# EAGLE design tiny (EAGLE 7.1.0)
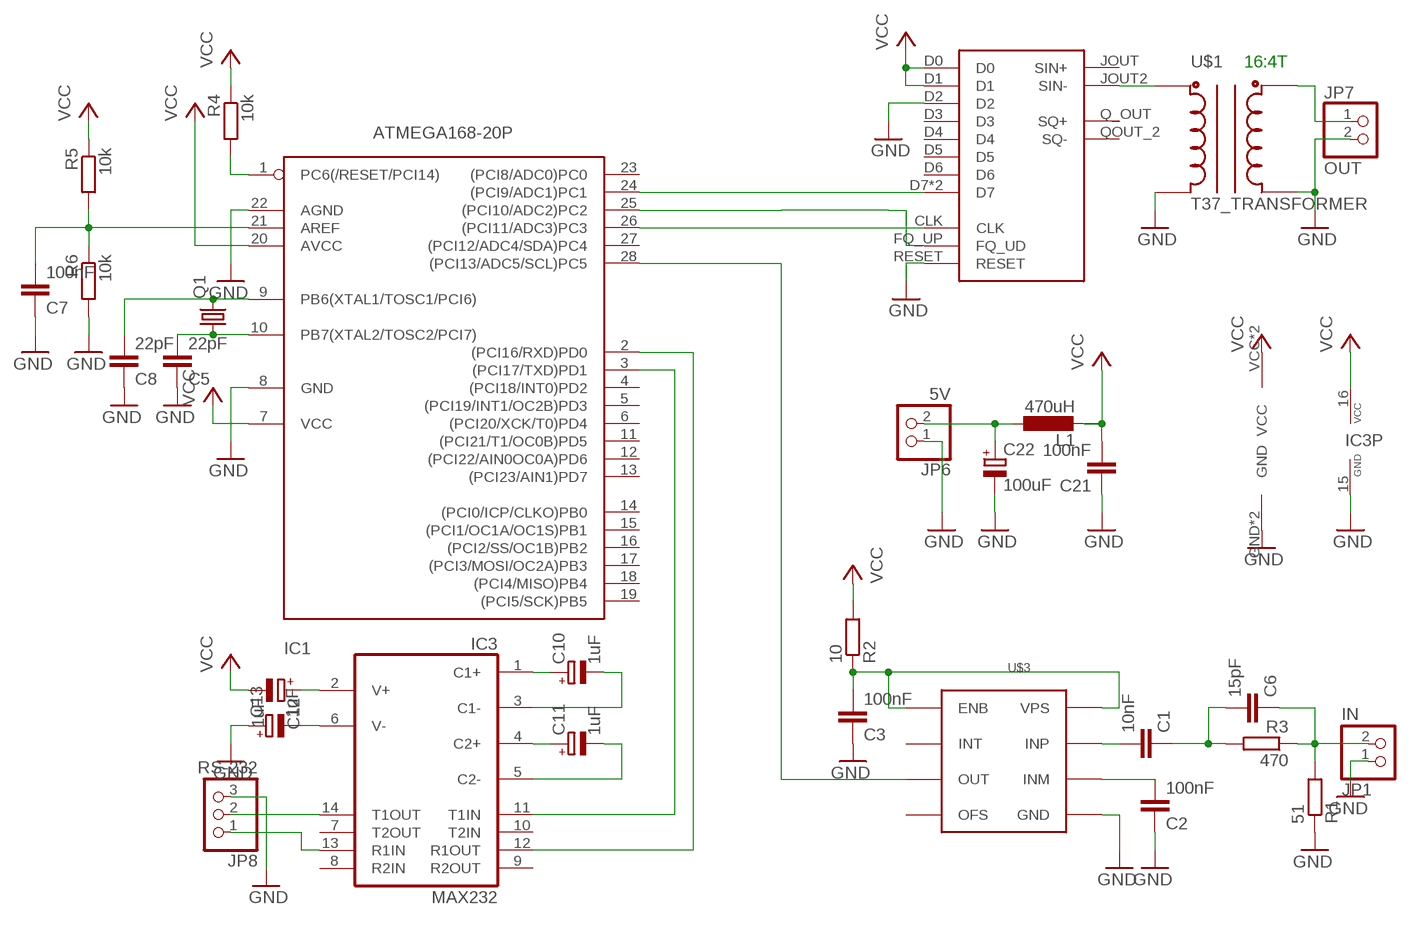
[diagram p0: schematic, sheet 1]

## Parts
C1  10nF  C-EU050-025X075  [C050-025X075]
C2  100nF  C-EU025-025X050  [C025-025X050]
C3  100nF  C-EU025-025X050  [C025-025X050]
C5  22pF  C-EU050-025X075  [C050-025X075]
C6  15pF  C-EU050-025X075  [C050-025X075]
C7  100nF  C-EU025-025X050  [C025-025X050]
C8  22pF  C-EU025-025X050  [C025-025X050]
C10  1uF  CPOL-EUE5-5  [E5-5]
C11  1uF  CPOL-EUE2.5-5  [E2,5-5]
C12  1uF  CPOL-EUE2.5-6  [E2,5-6]
C13  1uF  CPOL-EUE5-5  [E5-5]
C21  100nF  C-EU025-025X050  [C025-025X050]
C22  100uF  CPOL-EUE2.5-6  [E2,5-6]
IC1  ATMEGA168-20P  [DIL28-3]
IC3  MAX232  [DIL16]
JP1  IN  PINHD-1X2  [1X02]
JP6  5V  PINHD-1X2  [1X02]
JP7  OUT  PINHD-1X2  [1X02]
JP8  RS-232  PINHD-1X3  [1X03]
L1  470uH  L-EU0204/7  [0204/7]
Q1  CRYSTALHC18U-V  [HC18U-V]
R1  51  R-EU_0204/2V  [0204V]
R2  10  R-EU_0204/7  [0204/7]
R3  470  R-EU_0204/5  [0204/5]
R4  10k  R-EU_0204/7  [0204/7]
R5  10k  R-EU_0204/2V  [0204V]
R6  10k  R-EU_0204/2V  [0204V]
U$1  T37_TRANSFORMER  [T37_TRANSFORMER]
U$2  DDS-1  [DDS-1]
U$3  AD8307  [DIL08]

## Nets
GND: C2.1 C3.1 C5.1 C7.1 C8.1 C13.+ C21.1 C22.- IC1.8(GND) IC1.22(AGND) IC3.15(GND) JP1.1 JP6.1 JP7.2 JP8.3 R1.1 R6.2 U$1.C1A U$1.C2A U$2.D2 U$2.GND U$2.GND2(GND) U$2.RESET U$3.2(GND)
N$1: IC1.1(PC6(/RESET/PCI14)) R4.2
N$2: C6.1 JP1.2 R1.2 R3.1
N$3: C1.2 U$3.8(INP)
N$4: C2.2 U$3.1(INM)
N$5: C5.2 IC1.10(PB7(XTAL2/TOSC2/PCI7)) Q1.1
N$6: C8.2 IC1.9(PB6(XTAL1/TOSC1/PCI6)) Q1.2
N$7: C12.+ IC3.2(V+)
N$8: C3.2 R2.1 U$3.6(ENB) U$3.7(VPS)
N$9: IC1.28((PCI13/ADC5/SCL)PC5) U$3.4(OUT)
N$10: C22.+ JP6.2 L1.1
N$11: IC3.14(T1OUT) JP8.2
N$12: C1.1 C6.2 R3.2
N$13: U$1.C1B U$2.JOUT2(SIN-)
N$14: JP7.1 U$1.C2B
N$15: IC1.25((PCI10/ADC2)PC2) U$2.FQ_UP(FQ_UD)
N$16: C13.- IC3.6(V-)
N$17: IC1.3((PCI17/TXD)PD1) IC3.11(T1IN)
N$22: IC1.2((PCI16/RXD)PD0) IC3.12(R1OUT)
N$26: IC1.26((PCI11/ADC3)PC3) U$2.CLK
N$29: C7.2 IC1.21(AREF) R5.2 R6.1
N$30: IC1.24((PCI9/ADC1)PC1) U$2.D7 U$2.D7_2(D7)
N$34: IC3.13(R1IN) JP8.1
N$38: C10.+ IC3.1(C1+)
N$39: C10.- IC3.3(C1-)
N$40: C11.+ IC3.4(C2+)
N$41: C11.- IC3.5(C2-)
VCC: C12.- C21.2 IC1.7(VCC) IC1.20(AVCC) IC3.16(VCC) L1.2 R2.2 R4.1 R5.1 U$2.D0 U$2.D1 U$2.VCC U$2.VCC2(VCC)
Unconnected: IC1.4((PCI18/INT0)PD2) IC1.5((PCI19/INT1/OC2B)PD3) IC1.6((PCI20/XCK/T0)PD4) IC1.11((PCI21/T1/OC0B)PD5) IC1.12((PCI22/AIN0OC0A)PD6) IC1.13((PCI23/AIN1)PD7) IC1.14((PCI0/ICP/CLKO)PB0) IC1.15((PCI1/OC1A/OC1S)PB1) IC1.16((PCI2/SS/OC1B)PB2) IC1.17((PCI3/MOSI/OC2A)PB3) IC1.18((PCI4/MISO)PB4) IC1.19((PCI5/SCK)PB5) IC1.23((PCI8/ADC0)PC0) IC1.27((PCI12/ADC4/SDA)PC4) IC3.7(T2OUT) IC3.8(R2IN) IC3.9(R2OUT) IC3.10(T2IN) U$2.D3 U$2.D4 U$2.D5 U$2.D6 U$2.JOUT(SIN+) U$2.Q_OUT(SQ+) U$2.QOUT_2(SQ-) U$3.3(OFS) U$3.5(INT)

## Notes on the sheet
- 16:4T

## Library data of the parts
C1-C3 C5-C8 C21 = rcl:C-EU: CAPACITOR, European symbol
C10-C13 C22 = rcl:CPOL-EU: POLARIZED CAPACITOR, European symbol
IC1 = adafruit:ATMEGA168*P: MICROCONTROLLER 16 kBytes FLASH 1 kBytes SRAM 512 Bytes EEPROM USART 8-channel 10 bit ADC
IC3 = maxim:MAX232: RS232 TRANSCEIVER; MF: MAXIM; MPN: MAX232ACPE+; OC_FARNELL: 9723773; OC_NEWARK: 68K4544
JP1 JP6 JP7 = pinhead:PINHD-1X2: PIN HEADER
JP8 = pinhead:PINHD-1X3: PIN HEADER
L1 = rcl:L-EU: INDUCTOR, European symbol
Q1 = crystal:CRYSTAL: CRYSTAL; OC_FARNELL: unknown; OC_NEWARK: unknown
R1-R6 = rcl:R-EU_: RESISTOR, European symbol
U$1 = toroid:T37_TRANSFORMER: Transformer wound on a T37 Toroid
U$2 = minikits:DDS-1
U$3 = -- Eigene:AD8307

## Board
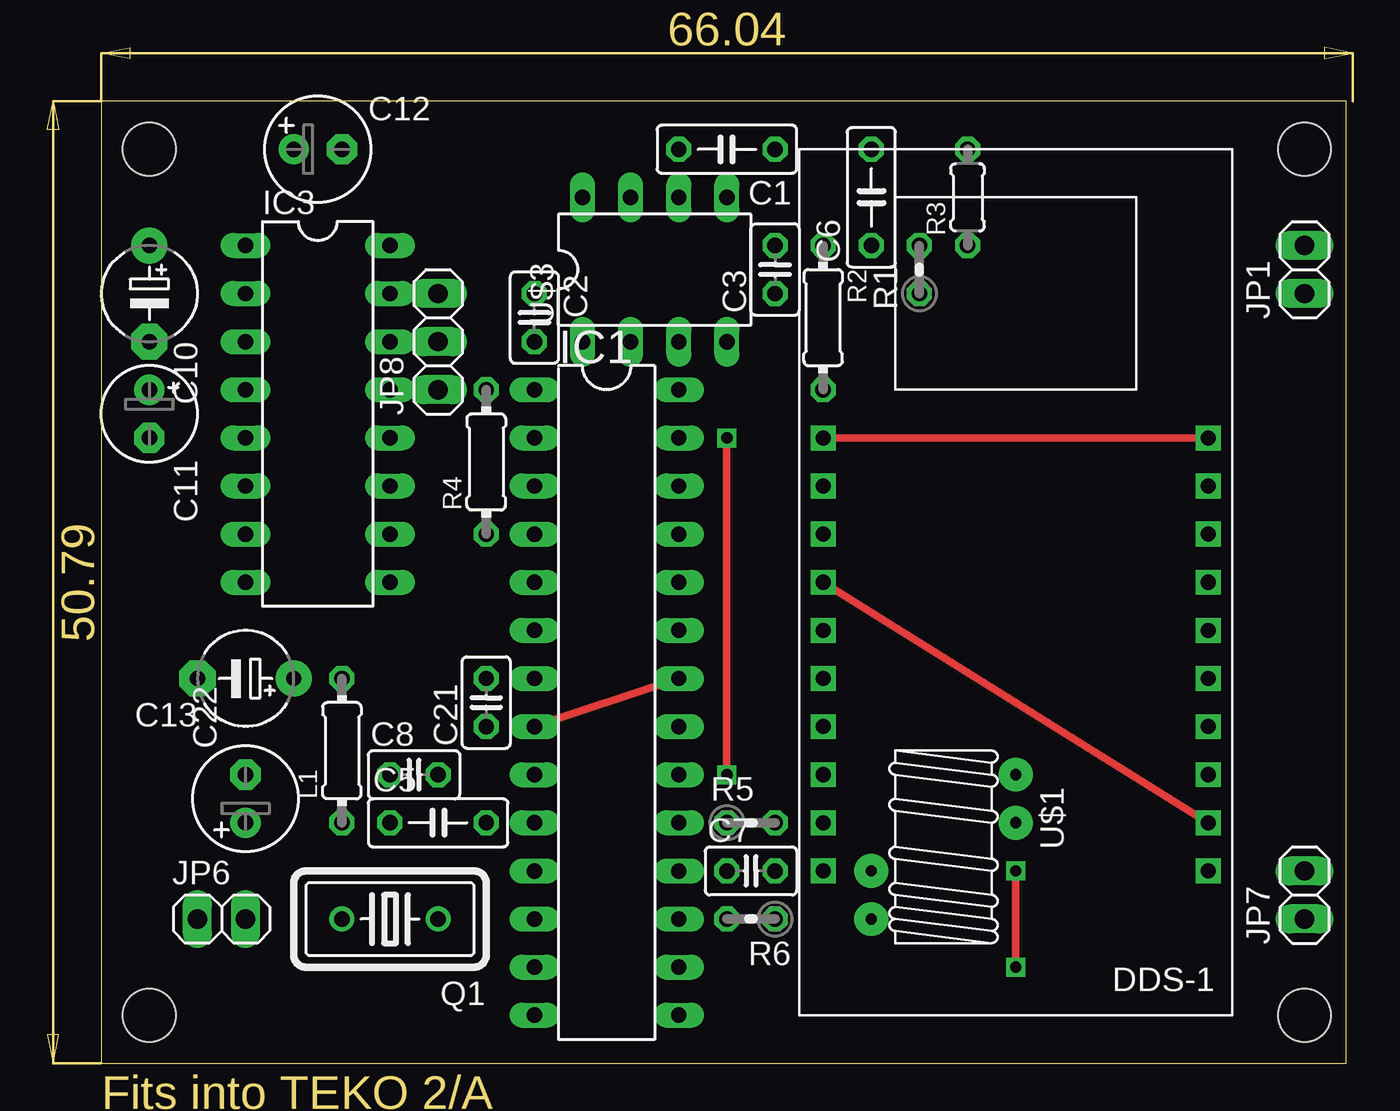
[diagram p1: board, top side]
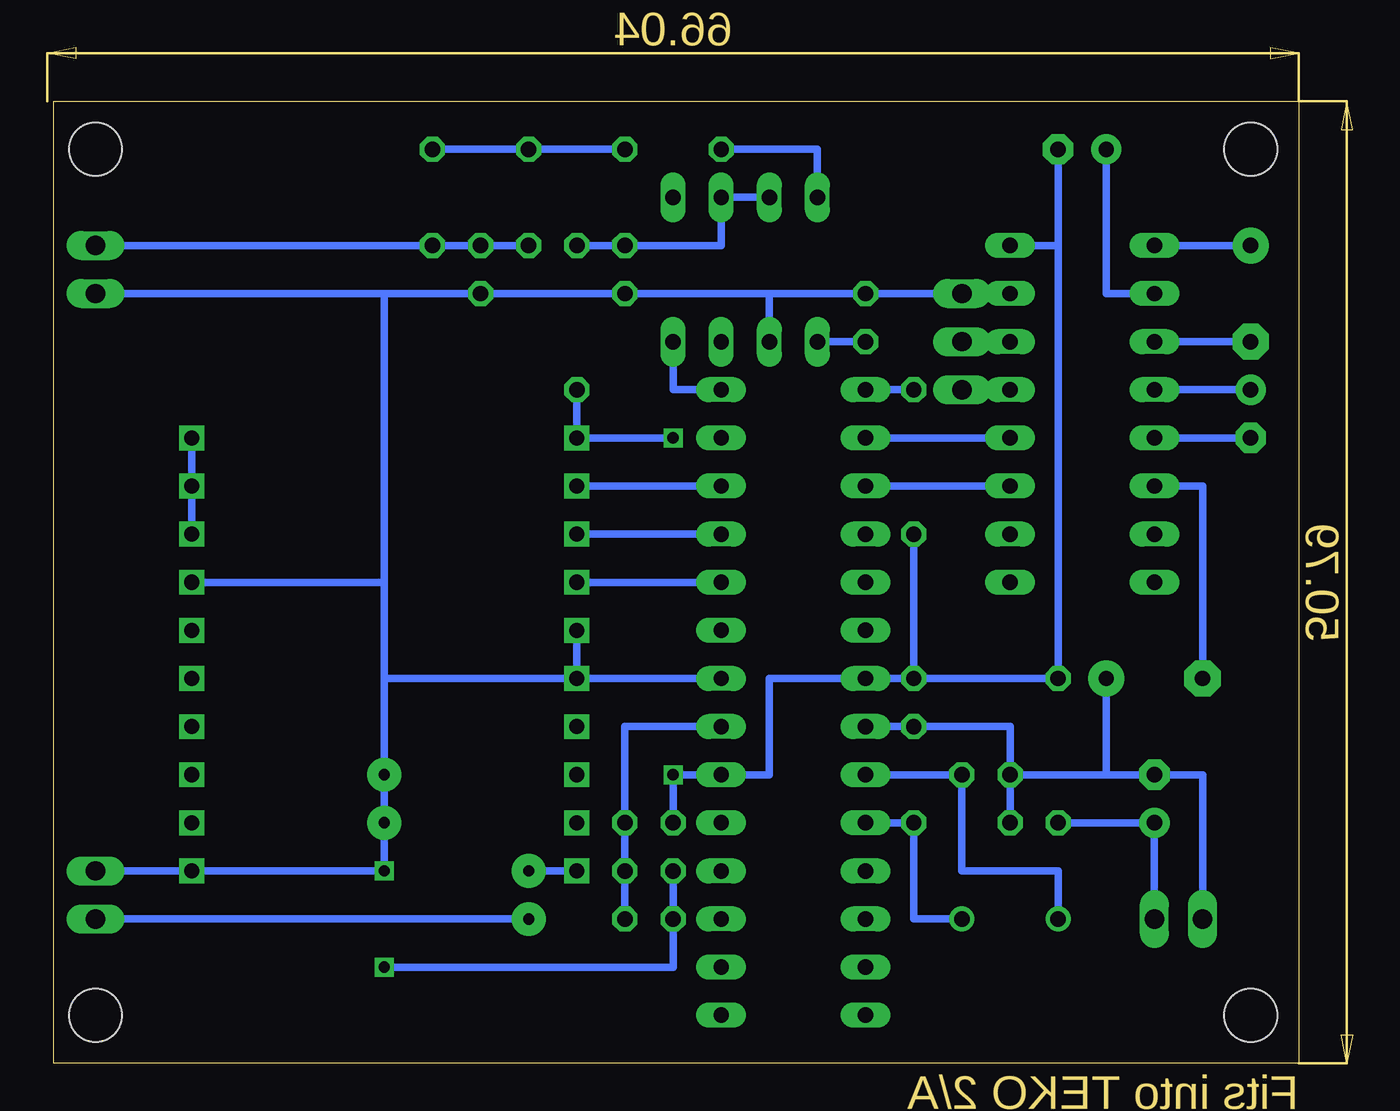
[diagram p2: board, bottom side, seen from below]

Size 65.71 x 50.79 mm. Coordinates in mm from the lower left corner, seen from the top.
Outline: 0,0 65.71,0 65.71,50.79 0,50.79 0,0
Copper layers (1*16): Top 0.035mm / dielectric 1.5mm / Bottom 0.035mm
Design rules "default": minimum track width 10mil, minimum drill 24mil, track to track 8mil, track to pad 8mil, pad to pad 8mil, via to via 8mil, smd to smd 8mil, copper to edge 40mil, drill to drill 8mil, minimum pad ring 10mil, minimum via ring 8mil, stop-mask expansion 4mil, vias tented up to drill 0mil, thermal gap 10mil
Holes 2.8 mm at 2.54,48.26 63.5,48.26 63.5,2.54 2.54,2.54

### Footprints (pad centres in the part's own frame; a part is rotated, then mirrored left to right if it is on the bottom)
C050-025X075 = drill 0.813 octagon: 1 -2.54,0; 2 2.54,0
C025-025X050 = drill 0.813 octagon: 1 -1.27,0; 2 1.27,0
E5-5 = drill 0.813 pad 1.905: + -2.54,0 | drill 0.813 pad 1.905 octagon: - 2.54,0
E2,5-5 = drill 0.813 pad 1.6: + -1.27,0 | drill 0.813 pad 1.6 octagon: - 1.27,0
E2,5-6 = drill 0.813 pad 1.6: + -1.27,0 | drill 0.813 pad 1.6 octagon: - 1.27,0
DIL28-3 = drill 0.813 long: 1 -16.51,-3.81; 2 -13.97,-3.81; 3 -11.43,-3.81; 4 -8.89,-3.81; 5 -6.35,-3.81; 6 -3.81,-3.81; 7 -1.27,-3.81; 8 1.27,-3.81; 9 3.81,-3.81; 10 6.35,-3.81; 11 8.89,-3.81; 12 11.43,-3.81; 13 13.97,-3.81; 14 16.51,-3.81; 15 16.51,3.81; 16 13.97,3.81; 17 11.43,3.81; 18 8.89,3.81; 19 6.35,3.81; 20 3.81,3.81; 21 1.27,3.81; 22 -1.27,3.81; 23 -3.81,3.81; 24 -6.35,3.81; 25 -8.89,3.81; 26 -11.43,3.81; 27 -13.97,3.81; 28 -16.51,3.81
DIL16 = drill 0.813 long: 1 -8.89,-3.81; 2 -6.35,-3.81; 3 -3.81,-3.81; 4 -1.27,-3.81; 5 1.27,-3.81; 6 3.81,-3.81; 7 6.35,-3.81; 8 8.89,-3.81; 9 8.89,3.81; 10 6.35,3.81; 11 3.81,3.81; 12 1.27,3.81; 13 -1.27,3.81; 14 -3.81,3.81; 15 -6.35,3.81; 16 -8.89,3.81
1X02 = drill 1.016 long: 1 -1.27,0; 2 1.27,0
1X03 = drill 1.016 long: 1 -2.54,0; 2 0,0; 3 2.54,0
0204/7 = drill 0.813 octagon: 1 -3.81,0; 2 3.81,0
HC18U-V = drill 0.813: 1 -2.54,0; 2 2.54,0
0204V = drill 0.813 octagon: 1 -1.27,0; 2 1.27,0
0204/5 = drill 0.813 octagon: 1 -2.54,0; 2 2.54,0
T37_TRANSFORMER = drill 0.6 pad 1.778: C1A -3.81,-3.81; C1B 3.81,1.27; C2A -3.81,-1.27; C2B 3.81,3.81
DDS-1 = drill 0.8 square: CLK -11.43,7.62; D0 8.89,7.62; D1 8.89,5.08; D2 8.89,2.54; D3 8.89,0; D4 8.89,-2.54; D5 8.89,-5.08; D6 8.89,-7.62; D7 -11.43,2.54; D7_2 8.89,-10.16; FQ_UP -11.43,5.08; GND -11.43,-2.54; GND2 8.89,-12.7; JOUT -11.43,-10.16; JOUT2 -11.43,-12.7; Q_OUT -11.43,-5.08; QOUT_2 -11.43,-7.62; RESET -11.43,0; VCC -11.43,10.16; VCC2 8.89,10.16
DIL08 = drill 0.813 long: 1 -3.81,-3.81; 2 -1.27,-3.81; 3 1.27,-3.81; 4 3.81,-3.81; 5 3.81,3.81; 6 1.27,3.81; 7 -1.27,3.81; 8 -3.81,3.81

### Placement (x,y rotation side)
C1  33.02,48.26 180 top
C2  22.86,39.37 270 top
C3  35.56,41.91 90 top
C5  17.78,12.7 0 top
C6  40.64,45.72 90 top
C7  34.29,10.16 0 top
C8  16.51,15.24 0 top
C10  2.54,40.64 270 top
C11  2.54,34.29 270 top
C12  11.43,48.26 0 top
C13  7.62,20.32 180 top
C21  20.32,19.05 90 top
C22  7.62,13.97 90 top
IC1  26.67,19.05 270 top
IC3  11.43,34.29 270 top
JP1  63.5,41.91 90 top
JP6  6.35,7.62 0 top
JP7  63.5,8.89 90 top
JP8  17.78,38.1 90 top
L1  12.7,16.51 90 top
Q1  15.24,7.62 180 top
R1  43.18,41.91 90 top
R2  38.1,39.37 270 top
R3  45.72,45.72 90 top
R4  20.32,31.75 90 top
R5  34.29,12.7 0 top
R6  34.29,7.62 180 top
U$1  44.45,11.43 180 top
U$2  49.53,22.86 0 top
U$3  29.21,41.91 0 top

### Tracks (layer width: path | path; a pad name or v marks a point on that pad's centre or on a via)
GND  (via drill 0.6)
  Top 0.406: IC1.8 IC1.22 | v48.26,5.08 v48.26,10.16
  Bottom 0.406: C2.1 27.94,40.64 | 27.94,40.64 U$3.2 | 27.94,40.64 34.29,40.64 | 34.29,40.64 C3.1 | C3.1 R1.1 | JP8.3 IC3.15 JP8.3 | JP8.3 20.32,40.64 C2.1 | IC1.8 C21.1 | C21.1 IC1.8 | U$2.GND U$2.RESET | U$2.D2 48.26,25.4 48.26,20.32 | 48.26,20.32 U$1.C2A | U$1.C2A v48.26,10.16 | v48.26,10.16 U$2.GND2 | U$1.C2A v48.26,10.16 | U$1.C2A U$1.C1A | 31.75,20.32 IC1.22 31.75,20.32 | U$2.GND 48.26,20.32 | 48.26,20.32 48.26,40.64 | C2.1 27.94,40.64 | R1.1 48.26,40.64 | R1.1 48.26,40.64 | 48.26,40.64 JP1.1 | C8.1 C22.- | C5.1 C8.1 | C22.- 10.16,15.24 10.16,17.78 C13.+ | C21.1 IC1.8 | C3.1 34.29,40.64 | JP7.2 U$2.GND2 | U$2.GND2 JP7.2 | JP7.2 v48.26,10.16 | v48.26,10.16 U$1.C2A | U$1.C2A U$1.C1A | U$1.C1A 48.26,20.32 | C22.- 5.08,15.24 JP6.1 | 31.75,20.32 U$2.GND | C7.1 R6.2 33.02,5.08 v48.26,5.08 | v48.26,10.16 U$1.C2A | C21.1 15.24,17.78 C8.1
N$1
  Bottom 0.406: R4.2 IC1.1
N$2
  Bottom 0.406: JP1.2 R3.1 R1.2 C6.1
N$3
  Bottom 0.406: C1.2 25.4,48.26 U$3.8
N$4
  Bottom 0.406: C2.2 U$3.1
N$5
  Bottom 0.406: IC1.10 C5.2 20.32,7.62 Q1.1
N$6
  Bottom 0.406: Q1.2 12.7,10.16 17.78,10.16 C8.2 IC1.9
N$7
  Bottom 0.406: IC3.2 10.16,40.64 C12.+
N$8
  Bottom 0.406: U$3.7 U$3.6 30.48,43.18 C3.2 R2.1
N$9
  Bottom 0.406: IC1.28 33.02,35.56 U$3.4
N$10
  Bottom 0.406: JP6.2 C22.+ L1.1
N$11
  Bottom 0.406: IC3.14 JP8.2
N$12
  Bottom 0.406: C1.1 C6.2 R3.2
N$13
  Bottom 0.406: U$2.JOUT2 U$1.C1B
N$14
  Bottom 0.406: JP7.1 U$1.C2B
N$15
  Bottom 0.406: IC1.25 U$2.FQ_UP
N$16
  Bottom 0.406: IC3.6 5.08,30.48 C13.-
N$17
  Bottom 0.406: IC3.11 IC1.3
N$22
  Bottom 0.406: IC1.2 IC3.12
N$26
  Bottom 0.406: IC1.26 U$2.CLK
N$29
  Bottom 0.406: IC1.21 35.56,17.78 R5.2 C7.2 R6.1
N$30
  Top 0.406: U$2.D7 U$2.D7_2
  Bottom 0.406: IC1.24 U$2.D7
N$34
  Bottom 0.406: JP8.1 IC3.13
N$38
  Bottom 0.406: C10.+ IC3.1
N$39
  Bottom 0.406: IC3.3 C10.-
N$40
  Bottom 0.406: C11.+ IC3.4
N$41
  Bottom 0.406: IC3.5 C11.-
VCC  (via drill 0.6)
  Top 0.406: U$2.VCC U$2.VCC2 | v33.02,33.02 v33.02,15.24
  Bottom 0.406: IC3.16 12.7,43.18 | IC1.7 C21.2 | U$2.VCC2 U$2.D0 U$2.D1 | v33.02,33.02 U$2.VCC R2.2 | 12.7,43.18 L1.2 C21.2 | IC1.7 27.94,20.32 27.94,15.24 IC1.20 v33.02,15.24 R5.1 | C21.2 IC1.7 | R4.1 C21.2 | C12.- 12.7,43.18

### Text on the board
Dimension: Fits into TEKO 2/A / conrad 520020